# Altium schematic sheet Sheet2.SchDoc: Наименование
size 420 x 297 mm; ApprovedBy: Утвердил; CheckedBy: Проверил; Author: Разработал; CompanyName: Организация; DrawnBy: Н.Контр; Engineer: Т.Контр; SheetNumber: 1; SheetTotal: 1; PageSetup: Record=PageOptions|CenterHorizontal=True|CenterVertical=True|PrintScale=0.94|XCorrection=1.00|YCorrection=1.00|PrintKind=1|BorderSize=5000000|LeftOffset=0|BottomOffset=0|Orientation=1|PaperLength=1000|PaperWidth=1000|Scale=100|PaperSource=7|PrintQuality=-4|MediaType=1|DitherType=10|PaperKind=A4|PrintScaleMode=1; DecimalNumber: Децимальный номер; HeadOfSector: Нач. сектора; MainDevice: Перв.примен.; Name: Наименование; DocumentName: Sheet1.SCHDOC
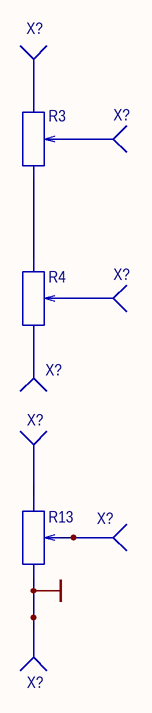
[diagram p0: Sheet2.SchDoc]

## Parts
(Parts that share a designator on the sheet are numbered #1, #2 ... from top to bottom, then left to right.)
R3  WH148  [WH148R]  (value not drawn)
R4  WH148  [WH148R]  (value not drawn)
R13  WH148  [WH148R]  (value not drawn)
X?#1  SMT_Contact  [SMT_CONTACT_TYPE_1]  (value not drawn)
X?#2  SMT_Contact  [SMT_CONTACT_TYPE_1]  (value not drawn)
X?#3  SMT_Contact  [SMT_CONTACT_TYPE_1]  (value not drawn)
X?#4  SMT_Contact  [SMT_CONTACT_TYPE_1]  (value not drawn)
X?#5  SMT_Contact  [SMT_CONTACT_TYPE_1]  (value not drawn)
X?#6  SMT_Contact  [SMT_CONTACT_TYPE_1]  (value not drawn)
X?#7  SMT_Contact  [SMT_CONTACT_TYPE_1]  (value not drawn)

## Nets
GND: R13.3 X?#7.1
NetR3_1: R3.1 X?#1.1
NetR3_2: R3.2 X?#2.1
NetR3_3: R3.3 R4.1
NetR4_2: R4.2 X?#3.1
NetR4_3: R4.3 X?#4.1
NetR13_1: R13.1 X?#5.1
NetR13_2: R13.2 X?#6.1

## Notes on the sheet
- Перв.примен.
- Справ.№
- Подп. и дата
- Инв.№ дубл.
- Взам.инв.№
- Подп.и дата
- Разраб.
- Изм.
- Лист
- № докум.
- Подп.
- Дата
- Лит.
- Масштаб
- Масса
- Т.контр.
- Пров.
- СХЕМА   ЭЛЕКТРИЧЕСКАЯ
- ПРИНЦИПИАЛЬНАЯ
- Листов
- Инв.№ подл.
- Утв.
- Н.контр.
- Нач.сект.
- Формат  A3